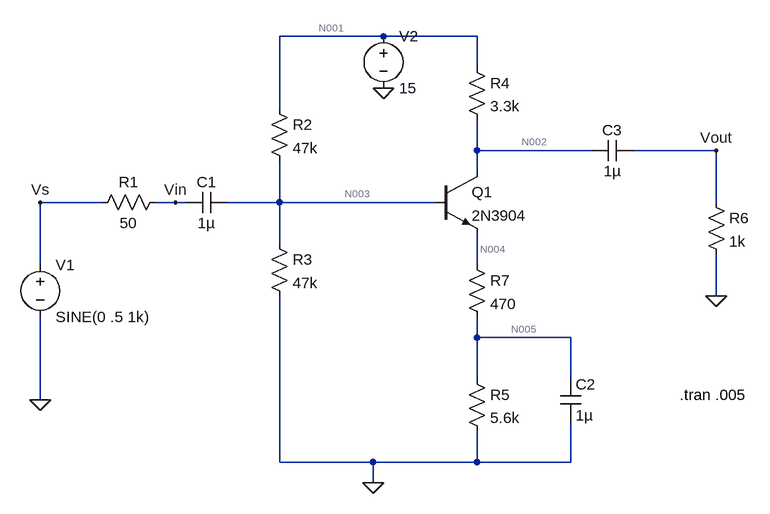
[diagram p0: schematic lab6.asc]
lab6.asc, the LTspice schematic file:
Version 4
SHEET 1 1108 680
WIRE 528 -160 368 -160
WIRE 672 -160 528 -160
WIRE 672 -112 672 -160
WIRE 368 -48 368 -160
WIRE 672 16 672 -32
WIRE 848 16 672 16
WIRE 1040 16 912 16
WIRE 672 48 672 16
WIRE 96 96 0 96
WIRE 208 96 176 96
WIRE 224 96 208 96
WIRE 368 96 368 32
WIRE 368 96 288 96
WIRE 608 96 368 96
WIRE 1040 96 1040 16
WIRE 368 160 368 96
WIRE 0 192 0 96
WIRE 672 192 672 144
WIRE 1040 240 1040 176
WIRE 672 304 672 272
WIRE 816 304 672 304
WIRE 672 368 672 304
WIRE 816 368 816 304
WIRE 0 400 0 272
WIRE 368 496 368 240
WIRE 512 496 368 496
WIRE 672 496 672 448
WIRE 672 496 512 496
WIRE 816 496 816 432
WIRE 816 496 672 496
WIRE 512 528 512 496
FLAG 0 400 0
FLAG 528 -80 0
FLAG 512 528 0
FLAG 1040 240 0
FLAG 0 96 Vs
FLAG 208 96 Vin
FLAG 1040 16 Vout
SYMBOL voltage 0 176 R0
WINDOW 123 0 0 Left 0
WINDOW 39 0 0 Left 0
SYMATTR InstName V1
SYMATTR Value SINE(0 .5 1k)
SYMBOL res 192 80 R90
WINDOW 0 0 56 VBottom 2
WINDOW 3 32 56 VTop 2
SYMATTR InstName R1
SYMATTR Value 50
SYMBOL cap 288 80 R90
WINDOW 0 0 32 VBottom 2
WINDOW 3 32 32 VTop 2
SYMATTR InstName C1
SYMATTR Value 1µ
SYMBOL res 352 -64 R0
SYMATTR InstName R2
SYMATTR Value 47k
SYMBOL res 352 144 R0
SYMATTR InstName R3
SYMATTR Value 47k
SYMBOL voltage 528 -176 R0
WINDOW 123 0 0 Left 0
WINDOW 39 0 0 Left 0
SYMATTR InstName V2
SYMATTR Value 15
SYMBOL res 656 -128 R0
SYMATTR InstName R4
SYMATTR Value 3.3k
SYMBOL res 656 352 R0
SYMATTR InstName R5
SYMATTR Value 5.6k
SYMBOL cap 800 368 R0
SYMATTR InstName C2
SYMATTR Value 1µ
SYMBOL cap 912 0 R90
WINDOW 0 0 32 VBottom 2
WINDOW 3 32 32 VTop 2
SYMATTR InstName C3
SYMATTR Value 1µ
SYMBOL res 1024 80 R0
SYMATTR InstName R6
SYMATTR Value 1k
SYMBOL res 656 176 R0
SYMATTR InstName R7
SYMATTR Value 470
SYMBOL npn 608 48 R0
SYMATTR InstName Q1
SYMATTR Value 2N3904
TEXT 984 392 Left 2 !.tran .005

The netlist it stands for:
* lab6.asc
V1 Vs 0 SINE(0 .5 1k)
R1 Vin Vs 50
C1 N003 Vin 1µ
R2 N001 N003 47k
R3 N003 0 47k
V2 N001 0 15
R4 N001 N002 3.3k
R5 N005 0 5.6k
C2 N005 0 1µ
C3 Vout N002 1µ
R6 Vout 0 1k
R7 N004 N005 470
Q1 N002 N003 N004 0 2N3904
.model NPN NPN
.model PNP PNP
.lib standard.bjt
.tran .005
.backanno
.end

* Results of the author's LTspice run, read from the files saved beside the schematic
* Operating Point, zero values left out:
*   V(n003) = 7.416 V
*   V(n001) = 15 V
*   V(n002) = 11.34 V
*   V(n005) = 6.236 V
*   V(n004) = 6.759 V
*   Ic(Q1) = 1.11 mA
*   Ib(Q1) = 3.57 µA
*   Ie(Q1) = -1.114 mA
*   I(R7) = 1.114 mA
*   I(R5) = 1.114 mA
*   I(R4) = 1.11 mA
*   I(R3) = 157.8 µA
*   I(R2) = 161.4 µA
*   I(V2) = -1.271 mA
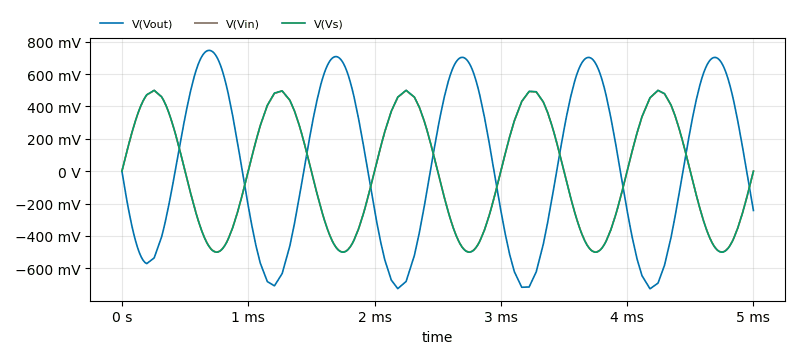
[diagram p1: Transient Analysis of lab6.asc, plotted from the saved traces]
* Transient Analysis, 1 run:
*   V(Vout): min -726.3 mV, max 746.4 mV, average 23 mV, rms 499.5 mV, last -242.4 mV
*   V(Vin): min -498.7 mV, max 498.6 mV, average -1.037 mV, rms 351.8 mV, last -48.99 µV
*   V(Vs): min -500 mV, max 499.9 mV, average -1.05 mV, rms 352.7 mV, last 0 V